# Altium schematic sheet RightEar.SchDoc
size A4; SheetNumber: 2; SheetTotal: 2
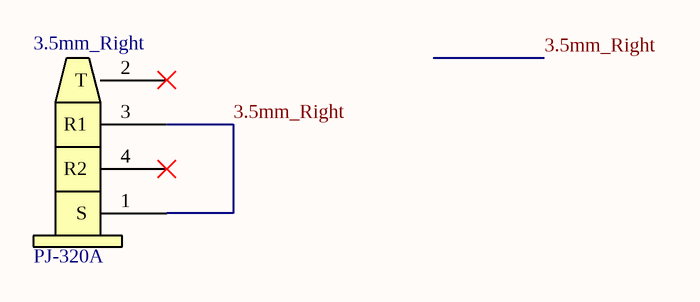
[diagram p0: RightEar.SchDoc]

## Parts
3.5mm_Right  PJ-320A  [PCBComponent_1]

## Nets
3.5mm_Right: 3.5mm_Right.1(S) 3.5mm_Right.3(R1)

Not connected (* = marked no-connect by the designer): 3.5mm_Right 2(T)* 4(R2)*

## Library data of the parts
3.5mm_Right = PJ-320A: A thru hole 3.5mm TRRS audio jack connector